# EAGLE design Raspberry_Pi_Bridge (EAGLE 9.2.2)
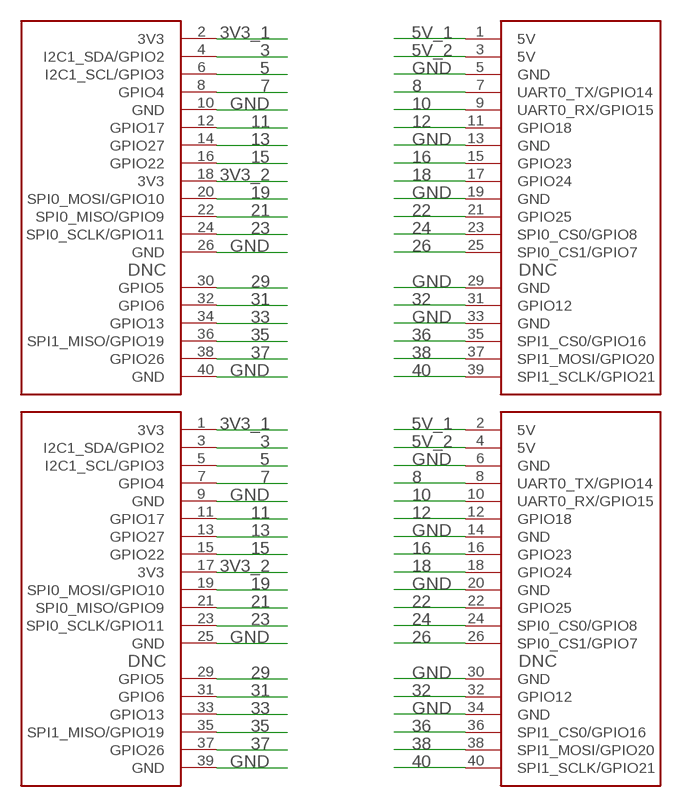
[diagram p0: schematic, sheet 1]

## Parts
U$1  RASPBERRY_PI  [_HEADER_2.54_2X20]
U$2  RASPBERRY_PI_MIRRORED  [_HEADER_2.54_2X20]

## Nets
3: U$1.3(I2C1_SDA/GPIO2) U$2.4(I2C1_SDA/GPIO2)
3V3_1: U$1.1(3V3) U$2.2(3V3)
3V3_2: U$1.17(3V3) U$2.18(3V3)
5: U$1.5(I2C1_SCL/GPIO3) U$2.6(I2C1_SCL/GPIO3)
5V_1: U$1.2(5V) U$2.1(5V)
5V_2: U$1.4(5V) U$2.3(5V)
7: U$1.7(GPIO4) U$2.8(GPIO4)
8: U$1.8(UART0_TX/GPIO14) U$2.7(UART0_TX/GPIO14)
10: U$1.10(UART0_RX/GPIO15) U$2.9(UART0_RX/GPIO15)
11: U$1.11(GPIO17) U$2.12(GPIO17)
12: U$1.12(GPIO18) U$2.11(GPIO18)
13: U$1.13(GPIO27) U$2.14(GPIO27)
15: U$1.15(GPIO22) U$2.16(GPIO22)
16: U$1.16(GPIO23) U$2.15(GPIO23)
18: U$1.18(GPIO24) U$2.17(GPIO24)
19: U$1.19(SPI0_MOSI/GPIO10) U$2.20(SPI0_MOSI/GPIO10)
21: U$1.21(SPI0_MISO/GPIO9) U$2.22(SPI0_MISO/GPIO9)
22: U$1.22(GPIO25) U$2.21(GPIO25)
23: U$1.23(SPI0_SCLK/GPIO11) U$2.24(SPI0_SCLK/GPIO11)
24: U$1.24(SPI0_CS0/GPIO8) U$2.23(SPI0_CS0/GPIO8)
26: U$1.26(SPI0_CS1/GPIO7) U$2.25(SPI0_CS1/GPIO7)
29: U$1.29(GPIO5) U$2.30(GPIO5)
31: U$1.31(GPIO6) U$2.32(GPIO6)
32: U$1.32(GPIO12) U$2.31(GPIO12)
33: U$1.33(GPIO13) U$2.34(GPIO13)
35: U$1.35(SPI1_MISO/GPIO19) U$2.36(SPI1_MISO/GPIO19)
36: U$1.36(SPI1_CS0/GPIO16) U$2.35(SPI1_CS0/GPIO16)
37: U$1.37(GPIO26) U$2.38(GPIO26)
38: U$1.38(SPI1_MOSI/GPIO20) U$2.37(SPI1_MOSI/GPIO20)
40: U$1.40(SPI1_SCLK/GPIO21) U$2.39(SPI1_SCLK/GPIO21)
GND: U$1.6(GND) U$1.9(GND) U$1.14(GND) U$1.20(GND) U$1.25(GND) U$1.30(GND) U$1.34(GND) U$1.39(GND) U$2.5(GND) U$2.10(GND) U$2.13(GND) U$2.19(GND) U$2.26(GND) U$2.29(GND) U$2.33(GND) U$2.40(GND)

## Library data of the parts
U$1 U$2 = Z:RASPBERRY_PI

## Board
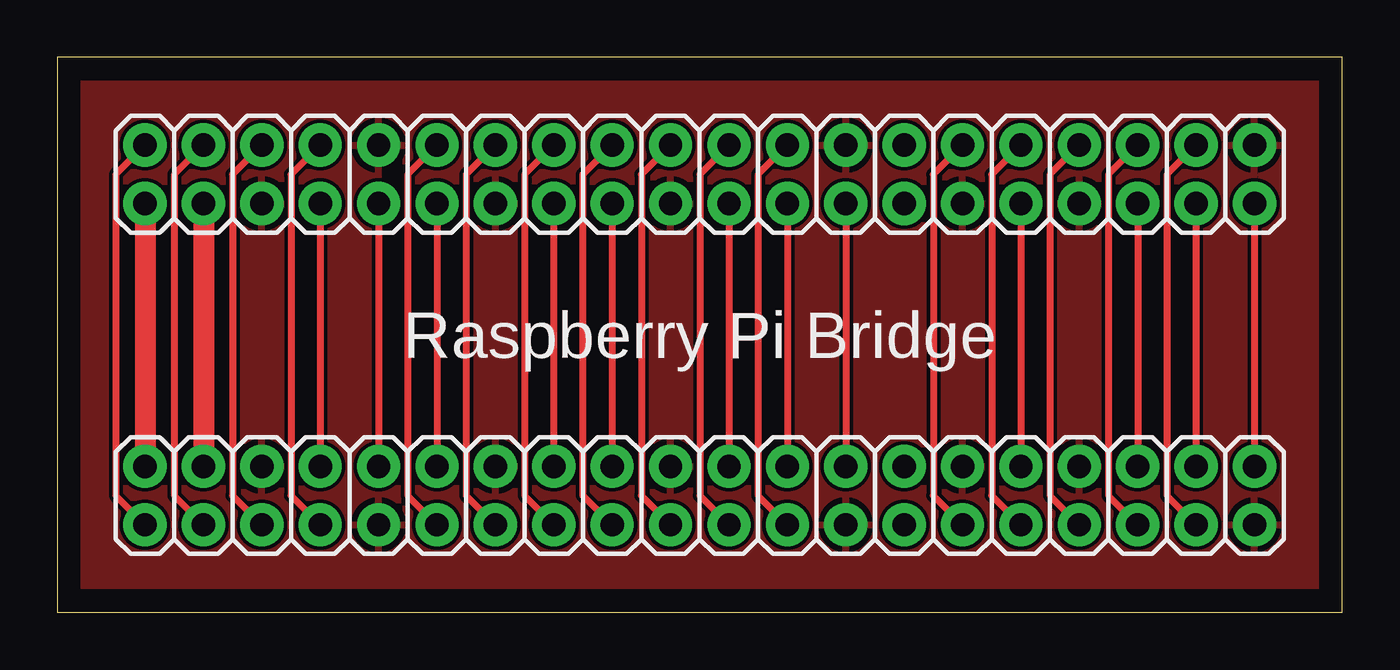
[diagram p1: board, top side]
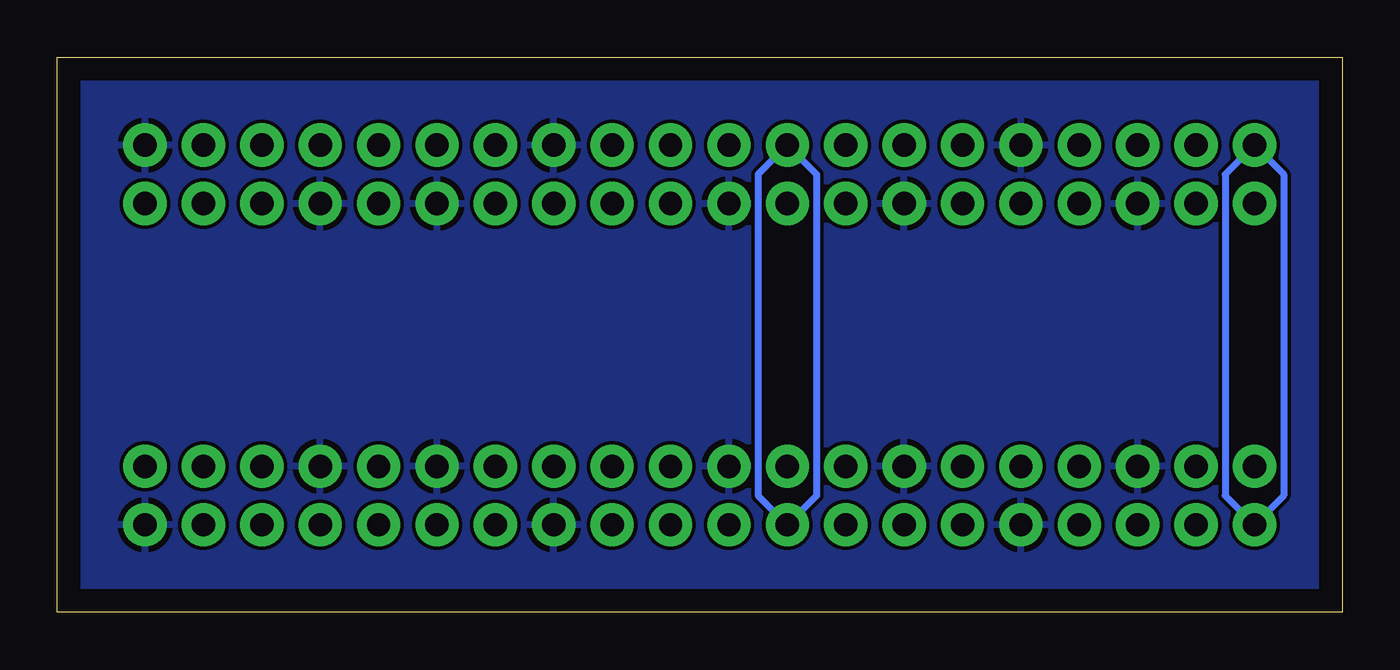
[diagram p2: board, bottom side, seen from below]

Size 55.88 x 24.13 mm. Coordinates in mm from the lower left corner, seen from the top.
Outline: 0,0 55.88,0 55.88,24.13 0,24.13 0,0
Copper layers (1*16): Top 0.035mm / dielectric 1.5mm / Bottom 0.035mm
Design rules "default": minimum track width 6mil, minimum drill 0.35mm, track to track 6mil, track to pad 6mil, pad to pad 6mil, via to via 6mil, smd to smd 6mil, copper to edge 40mil, drill to drill 6mil, minimum pad ring 10mil, minimum via ring 8mil, stop-mask expansion 4mil, vias tented up to drill 0mil, thermal gap 10mil

### Footprints (pad centres in the part's own frame; a part is rotated, then mirrored left to right if it is on the bottom)
_HEADER_2.54_2X20 = drill 1.016 pad 1.88: 1 0,0; 2 0,2.54; 3 2.54,0; 4 2.54,2.54; 5 5.08,0; 6 5.08,2.54; 7 7.62,0; 8 7.62,2.54; 9 10.16,0; 10 10.16,2.54; 11 12.7,0; 12 12.7,2.54; 13 15.24,0; 14 15.24,2.54; 15 17.78,0; 16 17.78,2.54; 17 20.32,0; 18 20.32,2.54; 19 22.86,0; 20 22.86,2.54; 21 25.4,0; 22 25.4,2.54; 23 27.94,0; 24 27.94,2.54; 25 30.48,0; 26 30.48,2.54; 27 33.02,0; 28 33.02,2.54; 29 35.56,0; 30 35.56,2.54; 31 38.1,0; 32 38.1,2.54; 33 40.64,0; 34 40.64,2.54; 35 43.18,0; 36 43.18,2.54; 37 45.72,0; 38 45.72,2.54; 39 48.26,0; 40 48.26,2.54

### Placement (x,y rotation side)
U$1  3.81,3.81 0 top
U$2  3.81,17.78 0 top

### Tracks (layer width: path | path; a pad name or v marks a point on that pad's centre or on a via)
3
  Top 0.305: U$2.4 5.08,19.05 5.08,5.08 U$1.3
3V3_1
  Top 0.305: U$2.2 2.54,19.05 2.54,5.08 U$1.1
  Bottom 0.305: U$2.2 2.54,19.05 2.54,5.08 U$1.1 5.08,5.08 5.08,19.05 U$2.2
3V3_2
  Top 0.305: U$2.18 22.86,19.05 22.86,5.08 U$1.17
  Bottom 0.305: U$2.18 22.86,19.05 22.86,5.08 U$1.17 25.4,5.08 25.4,19.05 U$2.18
5
  Top 0.305: U$2.6 7.62,19.05 7.62,5.08 U$1.5
5V_1
  Top 0.914: U$2.1 U$1.2
5V_2
  Top 0.914: U$2.3 U$1.4
7
  Top 0.305: U$2.8 10.16,19.05 10.16,5.08 U$1.7
8
  Top 0.305: U$2.7 U$1.8
10
  Top 0.305: U$2.9 U$1.10
11
  Top 0.305: U$2.12 15.24,19.05 15.24,5.08 U$1.11
12
  Top 0.305: U$2.11 U$1.12
13
  Top 0.305: U$2.14 17.78,19.05 17.78,5.08 U$1.13
15
  Top 0.305: U$2.16 20.32,19.05 20.32,5.08 U$1.15
16
  Top 0.305: U$2.15 U$1.16
18
  Top 0.305: U$2.17 U$1.18
19
  Top 0.305: U$2.20 25.4,19.05 25.4,5.08 U$1.19
21
  Top 0.305: U$2.22 27.94,19.05 27.94,5.08 U$1.21
22
  Top 0.305: U$2.21 U$1.22
23
  Top 0.305: U$2.24 30.48,19.05 30.48,5.08 U$1.23
24
  Top 0.305: U$2.23 U$1.24
26
  Top 0.305: U$2.25 U$1.26
29
  Top 0.305: U$2.30 38.1,19.05 38.1,5.08 U$1.29
31
  Top 0.305: U$2.32 40.64,19.05 40.64,5.08 U$1.31
32
  Top 0.305: U$2.31 U$1.32
33
  Top 0.305: U$2.34 43.18,19.05 43.18,5.08 U$1.33
35
  Top 0.305: U$2.36 45.72,19.05 45.72,5.08 U$1.35
36
  Top 0.305: U$2.35 U$1.36
37
  Top 0.305: U$2.38 48.26,19.05 48.26,5.08 U$1.37
38
  Top 0.305: U$2.37 U$1.38
40
  Top 0.305: U$2.39 U$1.40
GND
  pour Top: 0,24.13 0,0 55.88,0 55.88,24.13
  pour Bottom: 0,24.13 0,0 55.88,0 55.88,24.13

### Text on the board
tNames: Raspberry Pi Bridge